# Altium schematic sheet FILTER.SchDoc: FILTER
size A
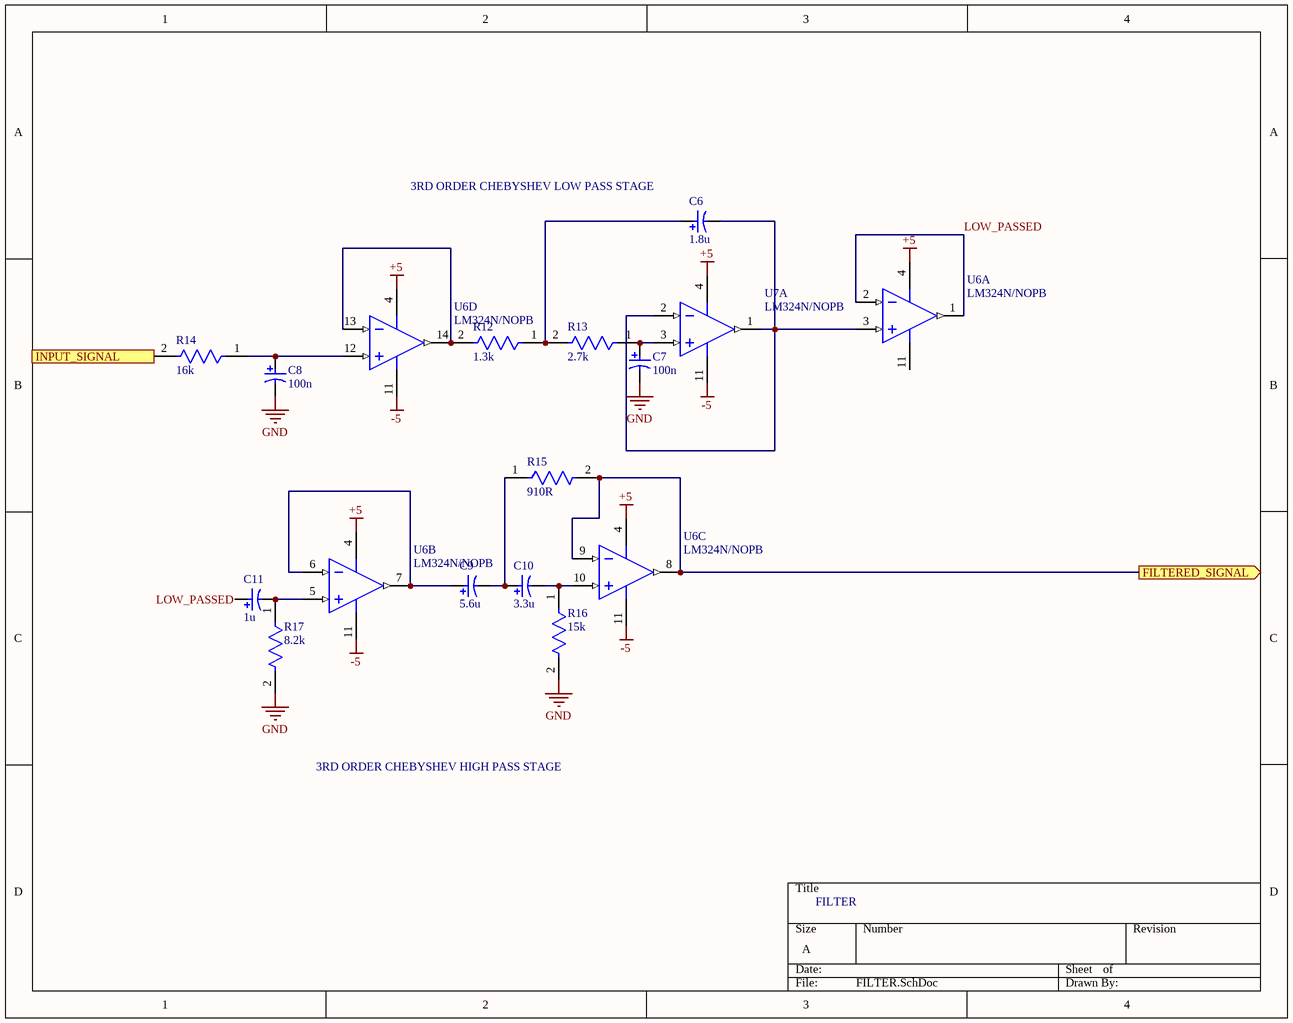
[diagram p0: FILTER.SchDoc]

## Parts
C6  1.8u  [PNSC-ECA-1VM221-2]
C7  100n  [PNSC-ECA-1VM221-2]
C8  100n  [PNSC-ECA-1VM221-2]
C9  5.6u  [PNSC-ECA-1VM221-2]
C10  3.3u  [PNSC-ECA-1VM221-2]
C11  1u  [PNSC-ECA-1VM221-2]
R12  1.3k  [FP-CF18-MFG]
R13  2.7k  [FP-CF18-MFG]
R14  16k  [FP-CF18-MFG]
R15  910R  [FP-CF18-MFG]
R16  15k  [FP-CF18-MFG]
R17  8.2k  [FP-CF18-MFG]
U6  LM324N/NOPB  [NFF0014A]  (parts A,B,C,D of 4)
U7  LM324N/NOPB  [NFF0014A]  (part A of 4)

## Ports
FILTERED_SIGNAL (out), INPUT_SIGNAL (in)

## Nets
+5: U6.4(V+) U7.4(V+)
-5: U6.11(GND) U7.11(GND)
GND: C7.2 C8.2 R16.2 R17.2
FILTERED_SIGNAL: R15.2 U6.8(OUT3) U6.9(IN3-) ; port FILTERED_SIGNAL
INPUT_SIGNAL: R14.2 ; port INPUT_SIGNAL
LOW_PASSED: C11.1 U6.1(OUT1) U6.2(IN1-)
NetC6_1: C6.1 R12.1 R13.2
NetC6_2: C6.2 U6.3(IN1+) U7.1(OUT1) U7.2(IN1-)
NetC7_1: C7.1 R13.1 U7.3(IN1+)
NetC8_1: C8.1 R14.1 U6.12(IN4+)
NetC9_1: C9.1 U6.6(IN2-) U6.7(OUT2)
NetC9_2: C9.2 C10.1 R15.1
NetC10_2: C10.2 R16.1 U6.10(IN3+)
NetC11_2: C11.2 R17.1 U6.5(IN2+)
NetR12_2: R12.2 U6.13(IN4-) U6.14(OUT4)

## Notes on the sheet
- 3RD ORDER CHEBYSHEV LOW PASS STAGE
- 3RD ORDER CHEBYSHEV HIGH PASS STAGE
- FILTER

## Library data of the parts
C6-C11 = CMP-2000-05311-1: Aluminum Electrolytic Capacitor, 220 uF, +/- 20%, 35 V, -40 to 85 degC, 2-Pin THD, RoHS, Bulk; Manufacturer: Panasonic; Lifetime@Temperature: 2000Hrs@85degC; Rated Voltage: 35V; Ripple Current: 350mA; Type: Radial; Capacitance: 220µF; Package Reference: ECA-1VM221; Series: M; Operating Temp Range: -40to+85degC; Package Description: 2-Pin Axial Lead, Dia 8 mm, Body Length 12.5 mm; Datasheet Version: Mar-06; Datasheet URL: https://datasheet.ciiva.com/26341/441851-da-01-en-elko-eca1vm221-m-r-220myf-35v-85c-26341906.pdf; Operating Temp-Max: 85degC; Case Size/Dimension: Ø8x11.5mm; Manufacturer URL: http://www.panasonic.com/
R12-R17 = CMP-26528-000001-1: RES 2.2K OHM 1/8W 5% CF AXIAL; Manufacturer: Stackpole Electronics Inc; Manufacturer Part Number: CF18JT2K20; Value: 2.2kΩ; Voltage Rating: 250V; Temperature Coefficient: 0/-400ppm/°C; Power Rating: 0.125W; Composition: Carbon Film; Octopart: https://octopart.com/cf18jt2k20-stackpole+electronics-19205714; Tolerance: 5%; Series: CF; Temperature Range Low: -55°C; ComponentLink2URL: https://www.seielect.com/catalog/sei-cf_cfm.pdf; Ipc Land Pattern Name: RESAD656W65L360D200; Package: CF18; Device Class L2: Resistors; Device Class L3: Through-Hole Resistors; Resistance: 2.2kΩ; Height: 2mm; Category: Res; ComponentLink2Description: Datasheet; Lead Free: Yes; Temperature Range High: +155°C; Temperature: -55°C to +155°C; RoHS: TRUE; Device Class L1: Passive Components; Digikey Description: RES 2.2K OHM 1/8W 5% CF AXIAL; Automotive: No
U6 U7 = CMP-0055-00116-3: Low Power Quad Operational Amplifier, 14-pin MDIP, Pb-Free; Manufacturer: Texas Instruments; PowerWise: N; CompType: Amplifiers; PackageTopMarking: NSUZXYYTTE#*LM324N; RoHS: Y; PinCount: 14; ComponentLink1URL: http://www.ti.com/general/docs/lit/getliterature.tsp?genericPartNumber=LM324-N&fileType=pdf; ComponentLink1Description: Datasheet URL; PackageDescription: MDIP, .750 x .250 x.130in, 14 Lead, .100in Pitch; Code_JEDEC: MS-001-AA; Package Reference: NFF0014A